# EAGLE design custom_hat_v_beta (EAGLE 9.6.2)
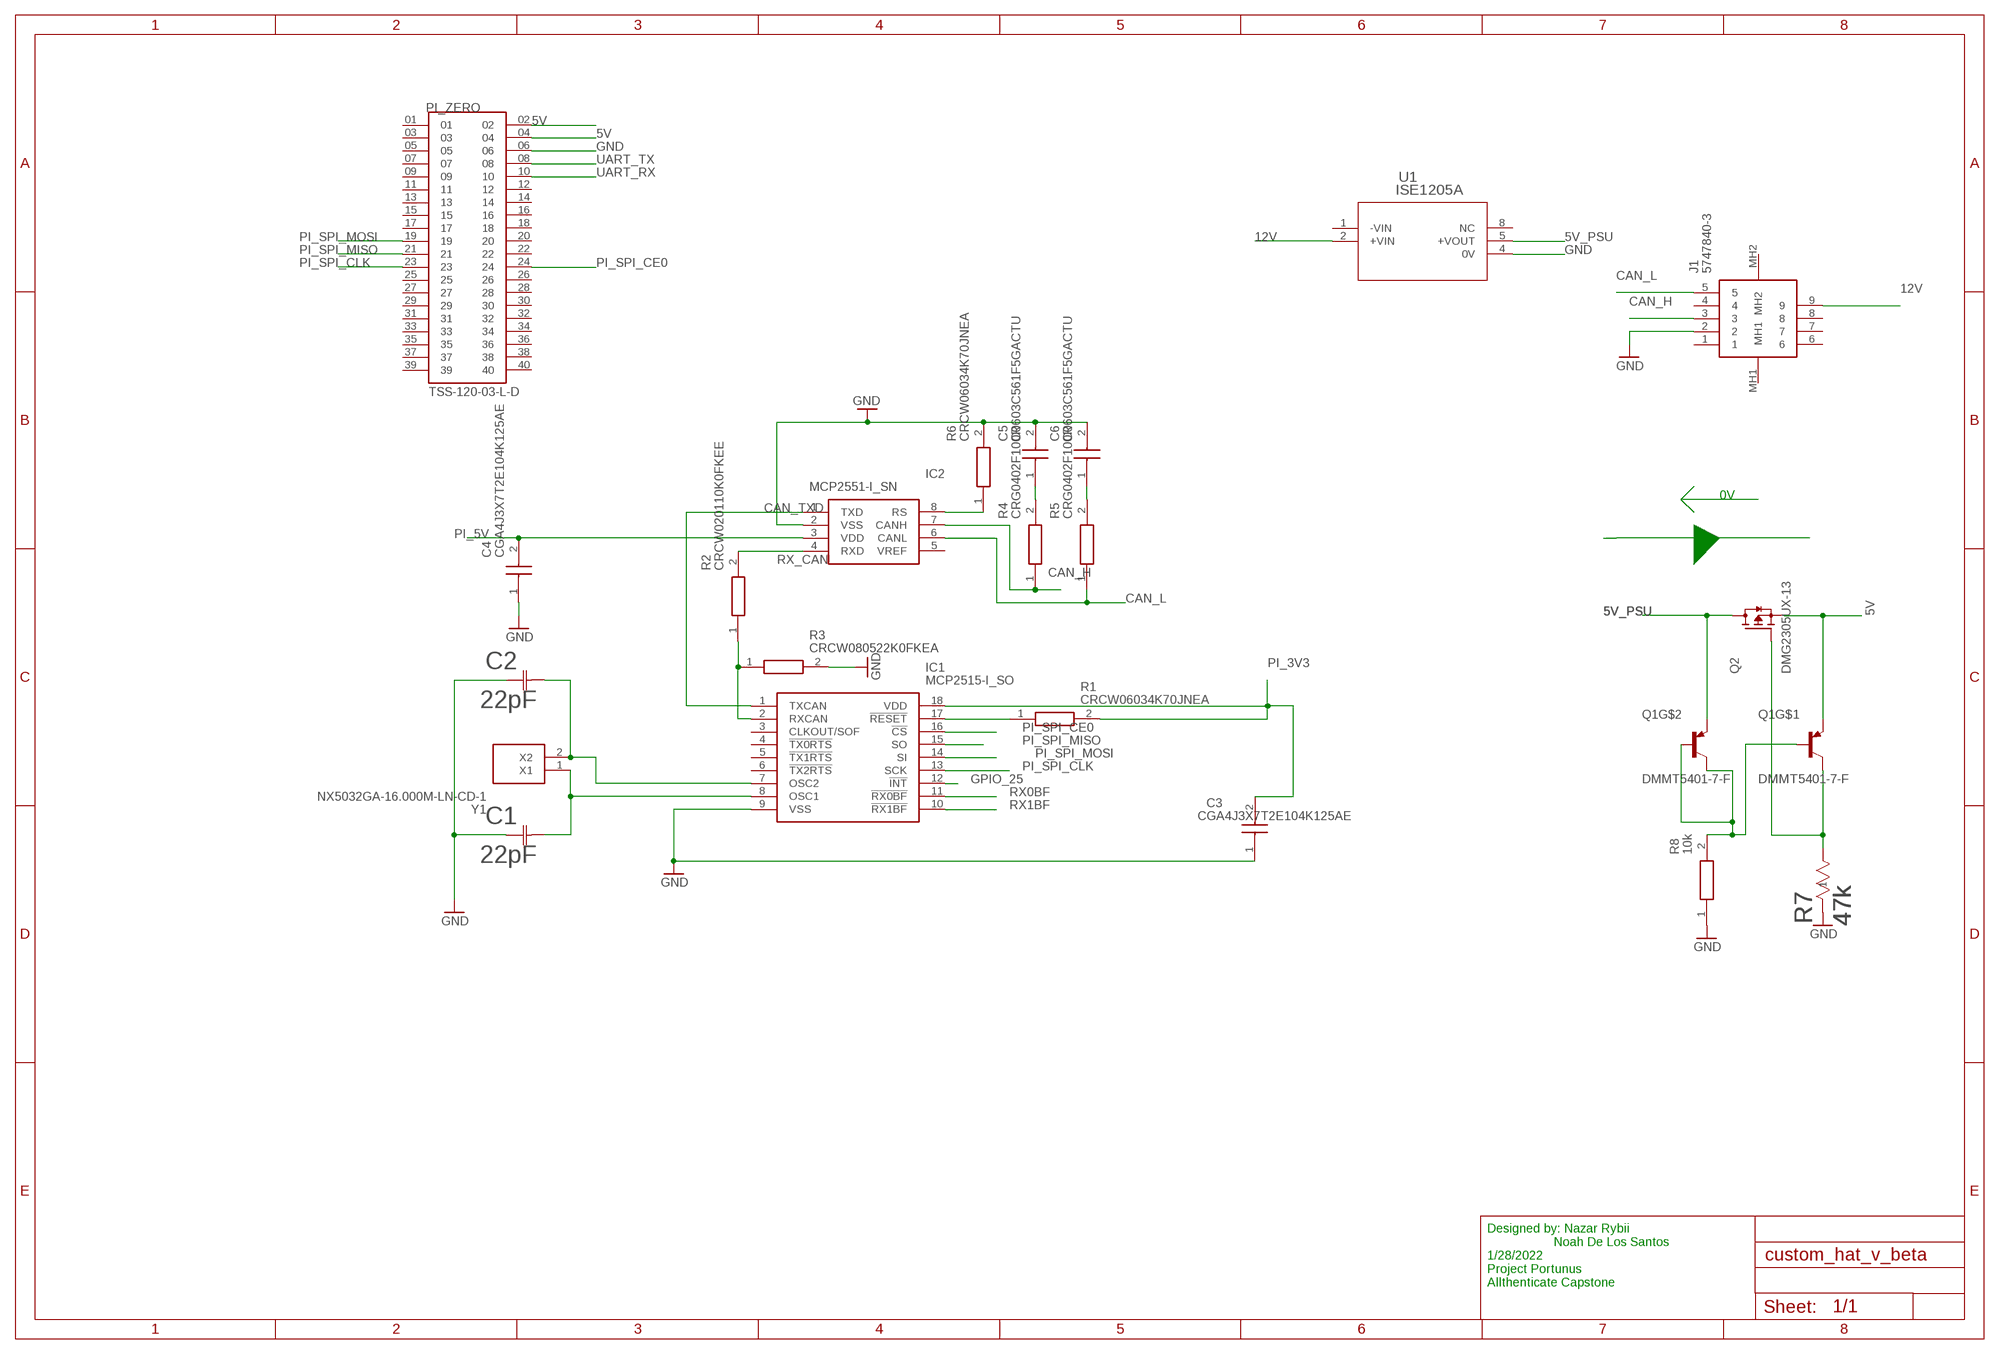
[diagram p0: schematic, sheet 1]

## Parts
C1  22pF  CL21C220JBANNNC  [CAP_CL21_SAM]
C2  22pF  CL21C220JBANNNC  [CAP_CL21_SAM]
C3  CGA4J3X7T2E104K125AE  [CAPC2012X145N]
C4  CGA4J3X7T2E104K125AE  [CAPC2012X145N]
C5  C0603C561F5GACTU  [CAPC1608X87N]
C6  C0603C561F5GACTU  [CAPC1608X87N]
IC1  MCP2515-I_SO  [SOIC127P1030X265-18N]
IC2  MCP2551-I_SN  [SOIC127P600X175-8N]
J1  5747840-3  [57478403]
PI_ZERO  TSS-120-03-L-D  [SAMTEC_TSS-120-03-L-D]
Q1  DMMT5401-7-F  [SOT95P285X140-6N]
Q2  DMG2305UX-13  [SOT91P240X110-3N]
R1  CRCW06034K70JNEA  [RESC1608X50N]
R2  CRCW020110K0FKEE  [RESC0603X28N]
R3  CRCW080522K0FKEA  [RESC2012X50N]
R4  CRG0402F100R  [RESC1005X40N]
R5  CRG0402F100R  [RESC1005X40N]
R6  CRCW06034K70JNEA  [RESC1608X50N]
R7  47k  RC0603FR-0747KL  [RC0603N_YAG]
R8  10k  CRCW080510K0FKEC  [RESC2012X50N]
U1  ISE1205A  [ISE1205A_XPP]
Y1  NX5032GA-16.000M-LN-CD-1  [NX5032GA16000000MHZLNCD1]

## Nets
5V: PI_ZERO.02 PI_ZERO.04 Q1.6(E) Q2.2(S)
5V_PSU: Q1.5(E) Q2.3(D) U1.5(+VOUT)
12V: J1.9 U1.2(+VIN)
CAN_H: IC2.7(CANH) J1.3 R4.1
CAN_L: IC2.6(CANL) J1.5 R5.1
CAN_TXD: IC1.1(TXCAN) IC2.1(TXD)
GND: C1.1 C2.1 C3.1 C4.1 C5.2 C6.2 IC1.9(VSS) IC2.2(VSS) J1.2 PI_ZERO.06 R3.2 R6.2 R7.1 R8.1 U1.4(0V)
GPIO_25: IC1.12(!INT)
N$3: Q1.1(C) Q2.1(G) R7.2
N$4: Q1.2(B) Q1.3(B) Q1.4(C) R8.2
N$5: IC1.2(RXCAN) R2.1 R3.1
N$11: IC2.8(RS) R6.1
N$13: C1.2 IC1.8(OSC1) Y1.1(X1)
N$14: C2.2 IC1.7(OSC2) Y1.2(X2)
N$15: C5.1 R4.2
N$16: C6.1 R5.2
N$21: IC1.17(!RESET) R1.1
PI_3V3: C3.2 IC1.18(VDD) R1.2
PI_5V: C4.2 IC2.3(VDD)
PI_SPI_CE0: IC1.16(!CS) PI_ZERO.24
PI_SPI_CLK: IC1.13(SCK) PI_ZERO.23
PI_SPI_MISO: IC1.15(SO) PI_ZERO.21
PI_SPI_MOSI: IC1.14(SI) PI_ZERO.19
RX0BF: IC1.11(!RX0BF)
RX1BF: IC1.10(!RX1BF)
RX_CAN: IC2.4(RXD) R2.2
UART_RX: PI_ZERO.10
UART_TX: PI_ZERO.08
Unconnected: IC1.3(CLKOUT/SOF) IC1.4(!TX0RTS) IC1.5(!TX1RTS) IC1.6(!TX2RTS) IC2.5(VREF) J1.1 J1.4 J1.6 J1.7 J1.8 J1.MH1 J1.MH2 PI_ZERO.01 PI_ZERO.03 PI_ZERO.05 PI_ZERO.07 PI_ZERO.09 PI_ZERO.11 PI_ZERO.12 PI_ZERO.13 PI_ZERO.14 PI_ZERO.15 PI_ZERO.16 PI_ZERO.17 PI_ZERO.18 PI_ZERO.20 PI_ZERO.22 PI_ZERO.25 PI_ZERO.26 PI_ZERO.27 PI_ZERO.28 PI_ZERO.29 PI_ZERO.30 PI_ZERO.31 PI_ZERO.32 PI_ZERO.33 PI_ZERO.34 PI_ZERO.35 PI_ZERO.36 PI_ZERO.37 PI_ZERO.38 PI_ZERO.39 PI_ZERO.40 U1.8(NC)

## Notes on the sheet
- 0V
- Designed by: Nazar Rybii
                     Noah De Los Santos
  1/28/2022
  Project Portunus
  Allthenticate Capstone

## Power pins joined to a net without a drawn wire
-VIN: U1.1(-VIN)

## Library data of the parts
C1 C2 = Custom_Hat_Library:CL21C220JBANNNC; COPYRIGHT: Copyright (C) 2022 Ultra Librarian. All rights reserved.; DIGI-KEY_PART_NUMBER_1: 1276-1047-2-ND; DIGI-KEY_PART_NUMBER_2: 1276-1047-1-ND; DIGI-KEY_PART_NUMBER_3: 1276-1047-6-ND; MANUFACTURER_PART_NUMBER: CL21C220JBANNNC; MFR_NAME: Samsung
C3 C4 = CGA4J3X7T2E104K125AE:CGA4J3X7T2E104K125AE: Capacitor Auto CGA 0805 250V 100nF X7T Source: Datasheet <https://datasheet.datasheetarchive.com/originals/distributors/Datasheets-DGA3/268663.pdf>; ARROW_PART_NUMBER: CGA4J3X7T2E104K125AE; ARROW_PRICE-STOCK: https://www.arrow.com/en/products/cga4j3x7t2e104k125ae/tdk?region=nac; DESCRIPTION: Capacitor Auto CGA 0805 250V 100nF X7T; HEIGHT: 1.45mm; MANUFACTURER_NAME: TDK; MANUFACTURER_PART_NUMBER: CGA4J3X7T2E104K125AE; MOUSER_PART_NUMBER: 810-CGA4J3X7T2E104KS; MOUSER_PRICE-STOCK: https://www.mouser.co.uk/ProductDetail/TDK/CGA4J3X7T2E104K125AE?qs=FxQuwy19cyCLbVWBJ25BJQ%3D%3D
C5 C6 = C0603C561F5GACTU:C0603C561F5GACTU: Multilayer Ceramic Capacitors MLCC - SMD/SMT 50volts 560pF C0G 1% Source: Datasheet <https://content.kemet.com/datasheets/KEM_C1003_C0G_SMD.pdf>; ARROW_PART_NUMBER: C0603C561F5GACTU; ARROW_PRICE-STOCK: https://www.arrow.com/en/products/c0603c561f5gactu/kemet-corporation; DESCRIPTION: Multilayer Ceramic Capacitors MLCC - SMD/SMT 50volts 560pF C0G 1%; HEIGHT: 0.87mm; MANUFACTURER_NAME: Kemet; MANUFACTURER_PART_NUMBER: C0603C561F5GACTU; MOUSER_PART_NUMBER: 80-C0603C561F5G; MOUSER_PRICE-STOCK: https://www.mouser.co.uk/ProductDetail/KEMET/C0603C561F5GACTU?qs=6dm3P68XlMDTfPQcBRhXNA%3D%3D
IC1 = MCP2515-I_SO:MCP2515-I_SO: CAN Controller SPI data filtering SO18 Source: Datasheet <https://datasheet.datasheetarchive.com/originals/distributors/Datasheets-34/DSA-675138.pdf>; ARROW_PART_NUMBER: MCP2515-I/SO; ARROW_PRICE-STOCK: https://www.arrow.com/en/products/mcp2515-iso/microchip-technology?region=nac; DESCRIPTION: CAN Controller SPI data filtering SO18; HEIGHT: 2.65mm; MANUFACTURER_NAME: Microchip; MANUFACTURER_PART_NUMBER: MCP2515-I/SO; MOUSER_PART_NUMBER: 579-MCP2515-I/SO; MOUSER_PRICE-STOCK: https://www.mouser.co.uk/ProductDetail/Microchip-Technology/MCP2515-I-SO?qs=KwArPi4cUogGDbGnphOvtQ%3D%3D
IC2 = MCP2551-I_SN:MCP2551-I_SN: High Speed CAN Transceiver,MCP2551-I/SN Source: Datasheet <https://datasheet.datasheetarchive.com/originals/distributors/Datasheets-34/DSA-674994.pdf>; ARROW_PART_NUMBER: MCP2551-I/SN; ARROW_PRICE-STOCK: https://www.arrow.com/en/products/mcp2551-isn/microchip-technology?region=nac; DESCRIPTION: High Speed CAN Transceiver,MCP2551-I/SN; HEIGHT: 1.75mm; MANUFACTURER_NAME: Microchip; MANUFACTURER_PART_NUMBER: MCP2551-I/SN; MOUSER_PART_NUMBER: 579-MCP2551-I/SN; MOUSER_PRICE-STOCK: https://www.mouser.co.uk/ProductDetail/Microchip-Technology/MCP2551-I-SN?qs=9y3LFqDLL8L5zFfqqxdOHg%3D%3D
J1 = 5747840-3:5747840-3: TE Connectivity Amplimite HD-20 Series, 9 Way Right Angle Through Hole PCB D-sub Connector Plug, 2.74mm Pitch, with Source: Datasheet <https://www.te.com/commerce/DocumentDelivery/DDEController?Action=srchrtrv&DocNm=5747840&DocType=Customer Drawing&DocLang=English>; ARROW_PART_NUMBER: 5747840-3; ARROW_PRICE-STOCK: https://www.arrow.com/en/products/5747840-3/te-connectivity?region=nac; DESCRIPTION: TE Connectivity Amplimite HD-20 Series, 9 Way Right Angle Through Hole PCB D-sub Connector Plug, 2.74mm Pitch, with; HEIGHT: 12.93mm; MANUFACTURER_NAME: TE Connectivity; MANUFACTURER_PART_NUMBER: 5747840-3; MOUSER_PART_NUMBER: 571-5747840-3; MOUSER_PRICE-STOCK: https://www.mouser.co.uk/ProductDetail/TE-Connectivity/5747840-3?qs=x6EjVpvqMVNS%252B6EaV6pwhg%3D%3D
PI_ZERO = Custom_Hat_Library:TSS-120-03-L-D: Check availability <https://pricing.snapeda.com/parts/TSS-120-03-L-D/Samtec/view-part?ref=eda>; AVAILABILITY: In Stock; DESCRIPTION: Connector Header Through Hole 40 position 0.100 (2.54mm); MF: Samtec; MP: TSS-120-03-L-D; PACKAGE: None; PRICE: None; PURCHASE-URL: https://pricing.snapeda.com/search/part/TSS-120-03-L-D/?ref=eda
Q1 = Custom_Hat_Library:DMMT5401-7-F: DMMT5401 Series PNP 150 V 300 mW Small Signal Transistor SMT - SOT-26-6 Check availability <https://pricing.snapeda.com/parts/DMMT5401-7-F/Diodes%20Inc./view-part?ref=eda>; AVAILABILITY: In Stock; DESCRIPTION: Bipolar (BJT) Transistor Array 2 PNP (Dual) Matched Pair 150V 200mA 300MHz 300mW Surface Mount SOT-26; MF: Diodes Inc.; MP: DMMT5401-7-F; PACKAGE: SOT-23 Diodes Inc.; PRICE: None; PURCHASE-URL: https://pricing.snapeda.com/search/part/DMMT5401-7-F/?ref=eda
Q2 = Custom_Hat_Library:DMG2305UX-13: DMG2305UX Series 20 V 65 Ohms P-Ch Enhancement Mode Mosfet - SOT-23-3 Check availability <https://pricing.snapeda.com/parts/DMG2305UX-13/Diodes%20Inc./view-part?ref=eda>; AVAILABILITY: In Stock; DESCRIPTION: P-Channel 20 V 4.2A (Ta) 1.4W (Ta) Surface Mount SOT-23-3; MF: Diodes Inc.; MP: DMG2305UX-13; PACKAGE: SOT-23 Diodes Inc.; PRICE: None; PURCHASE-URL: https://pricing.snapeda.com/search/part/DMG2305UX-13/?ref=eda
R1 R6 = CRCW06034K70JNEA:CRCW06034K70JNEA: Vishay CRCW Series Thick Film Surface Mount Resistor 0603 Case 4.7k +/-5% 0.1W +/-200ppm/K Source: Datasheet <http://www.vishay.com/docs/20035/dcrcwe3.pdf>; ARROW_PART_NUMBER: CRCW06034K70JNEA; ARROW_PRICE-STOCK: https://www.arrow.com/en/products/crcw06034k70jnea/vishay; DESCRIPTION: Vishay CRCW Series Thick Film Surface Mount Resistor 0603 Case 4.7k +/-5% 0.1W +/-200ppm/K; HEIGHT: 0.5mm; MANUFACTURER_NAME: Vishay; MANUFACTURER_PART_NUMBER: CRCW06034K70JNEA; MOUSER_PART_NUMBER: 71-CRCW0603J-4.7K-E3; MOUSER_PRICE-STOCK: https://www.mouser.co.uk/ProductDetail/Vishay-Dale/CRCW06034K70JNEA?qs=C0xaqriB68jbLUpBrIbing%3D%3D
R2 = CRCW020110K0FKEE:CRCW020110K0FKEE: Standard Thick Film Chip Resistors value 10K0 ohm. Source: Datasheet <http://www.vishay.com/docs/20035/dcrcwe3.pdf>; ARROW_PART_NUMBER: CRCW020110K0FKEE; ARROW_PRICE-STOCK: https://www.arrow.com/en/products/crcw020110k0fkee/vishay; DESCRIPTION: Standard Thick Film Chip Resistors value 10K0 ohm.; HEIGHT: 0.28mm; MANUFACTURER_NAME: Vishay; MANUFACTURER_PART_NUMBER: CRCW020110K0FKEE
R3 = CRCW080522K0FKEA:CRCW080522K0FKEA: Vishay CRCW Series Thick Film Surface Mount Resistor 805 Case 22k +/-1% 0.125W +/-100ppm/C Source: Datasheet <http://www.vishay.com/docs/20035/dcrcwe3.pdf>; ARROW_PART_NUMBER: CRCW080522K0FKEA; ARROW_PRICE-STOCK: https://www.arrow.com/en/products/crcw080522k0fkea/vishay; DESCRIPTION: Vishay CRCW Series Thick Film Surface Mount Resistor 805 Case 22k +/-1% 0.125W +/-100ppm/C; HEIGHT: 0.5mm; MANUFACTURER_NAME: Vishay; MANUFACTURER_PART_NUMBER: CRCW080522K0FKEA; MOUSER_PART_NUMBER: 71-CRCW0805-22K-E3; MOUSER_PRICE-STOCK: https://www.mouser.co.uk/ProductDetail/Vishay-Dale/CRCW080522K0FKEA/?qs=fIsz7OpyEY835T0D7WGkRw%3D%3D
R4 R5 = CRG0402F100R:CRG0402F100R: TE Connectivity CRG0402 Series Thick Film Surface Mount Resistor 402 Case 100 +/-1% 0.063W +/-100ppm/C Source: Datasheet <https://datasheet.datasheetarchive.com/originals/distributors/DKDS-21/401698.pdf>; ARROW_PART_NUMBER: CRG0402F100R; ARROW_PRICE-STOCK: https://www.arrow.com/en/products/crg0402f100r/te-connectivity; DESCRIPTION: TE Connectivity CRG0402 Series Thick Film Surface Mount Resistor 402 Case 100 +/-1% 0.063W +/-100ppm/C; HEIGHT: 0.4mm; MANUFACTURER_NAME: TE Connectivity; MANUFACTURER_PART_NUMBER: CRG0402F100R; MOUSER_PART_NUMBER: 279-CRG0402F100R; MOUSER_PRICE-STOCK: https://www.mouser.co.uk/ProductDetail/TE-Connectivity-Holsworthy/CRG0402F100R?qs=s1WWODT2SXWUp2XB3WBFSA%3D%3D
R7 = Custom_Hat_Library:RC0603FR-0747KL; COPYRIGHT: Copyright (C) 2022 Ultra Librarian. All rights reserved.; DIGI-KEY_PART_NUMBER_1: 311-47.0KHRCT-ND; DIGI-KEY_PART_NUMBER_2: 311-47.0KHRDKR-ND; DIGI-KEY_PART_NUMBER_3: 311-47.0KHRTR-ND; DIGI-KEY_PART_NUMBER_4: 311-47.0KHRTR-NDL; MANUFACTURER_PART_NUMBER: RC0603FR-0747KL; MFR_NAME: Yageo
R8 = Custom_Hat_Library:CRCW080510K0FKEC: VISHAY - CRCW080510K0FKEC - RES, AEC-Q200, THICK FILM, 10K, 0805 Source: Datasheet <http://www.vishay.com/docs/20035/dcrcwe3.pdf>; ARROW_PART_NUMBER: CRCW080510K0FKEC; ARROW_PRICE-STOCK: https://www.arrow.com/en/products/crcw080510k0fkec/vishay; DESCRIPTION: VISHAY - CRCW080510K0FKEC - RES, AEC-Q200, THICK FILM, 10K, 0805; HEIGHT: 0.5mm; MANUFACTURER_NAME: Vishay; MANUFACTURER_PART_NUMBER: CRCW080510K0FKEC; MOUSER_PART_NUMBER: 71-CRCW080510K0FKEC; MOUSER_PRICE-STOCK: https://www.mouser.co.uk/ProductDetail/Vishay-Dale/CRCW080510K0FKEC?qs=Uz%2FpZV6aOq01IlV1moChPA%3D%3D
U1 = Custom_Hat_Library:ISE1205A; COPYRIGHT: Copyright (C) 2022 Ultra Librarian. All rights reserved.; DIGI-KEY_PART_NUMBER_1: 1470-2948-2-ND; DIGI-KEY_PART_NUMBER_2: 1470-2948-1-ND; DIGI-KEY_PART_NUMBER_3: 1470-2948-6-ND; DIGI-KEY_PART_NUMBER_4: ISE1205A-ND; MANUFACTURER_PART_NUMBER: ISE1205A; MFR_NAME: XP Power
Y1 = NX5032GA-16.000M-LN-CD-1:NX5032GA-16.000M-LN-CD-1: Crystals CRYSTAL 16MHZ 8PF SMD Source: Datasheet <https://media.digikey.com/pdf/Data Sheets/NDK PDFs/NX5032GA.pdf>; DESCRIPTION: Crystals CRYSTAL 16MHZ 8PF SMD; HEIGHT: 1.5mm; MANUFACTURER_NAME: NDK; MANUFACTURER_PART_NUMBER: NX5032GA-16.000M-LN-CD-1; MOUSER_PART_NUMBER: 344-NX5032GA16MLNCD1; MOUSER_PRICE-STOCK: https://www.mouser.co.uk/ProductDetail/NDK/NX5032GA-16000M-LN-CD-1?qs=55YtniHzbhDnyNixVDBwYw%3D%3D

## Board
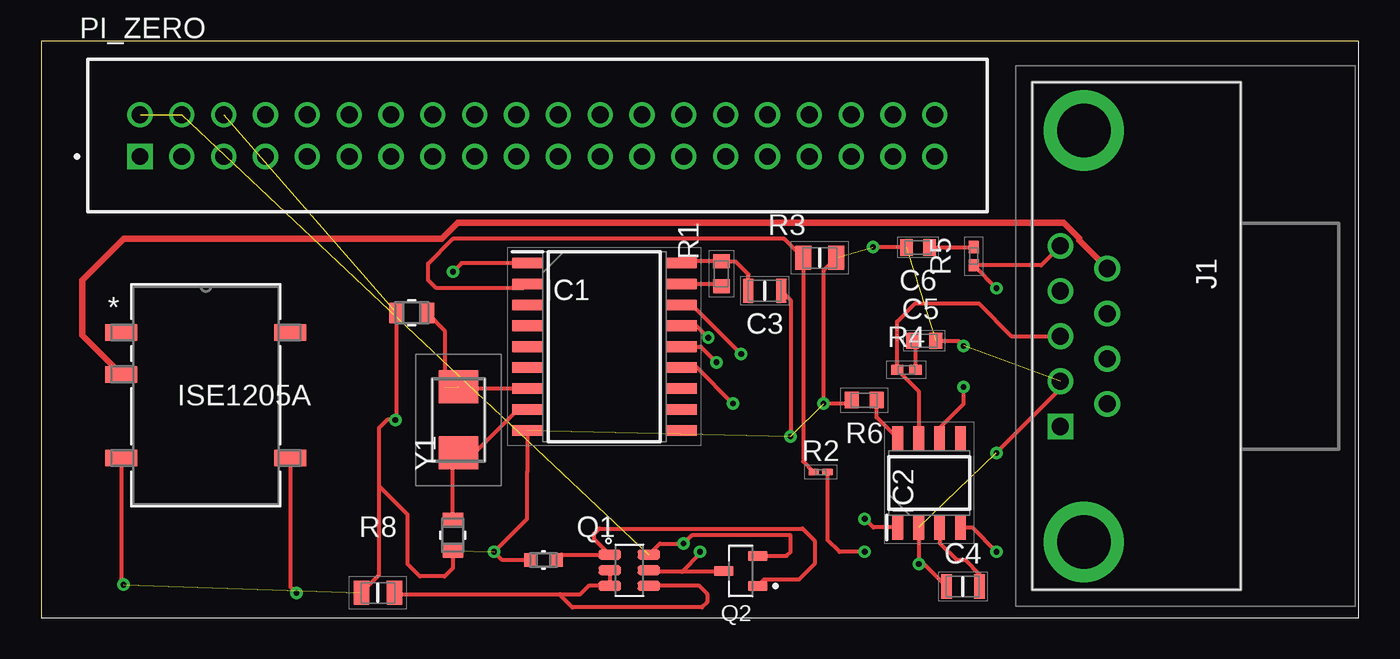
[diagram p1: board, top side]
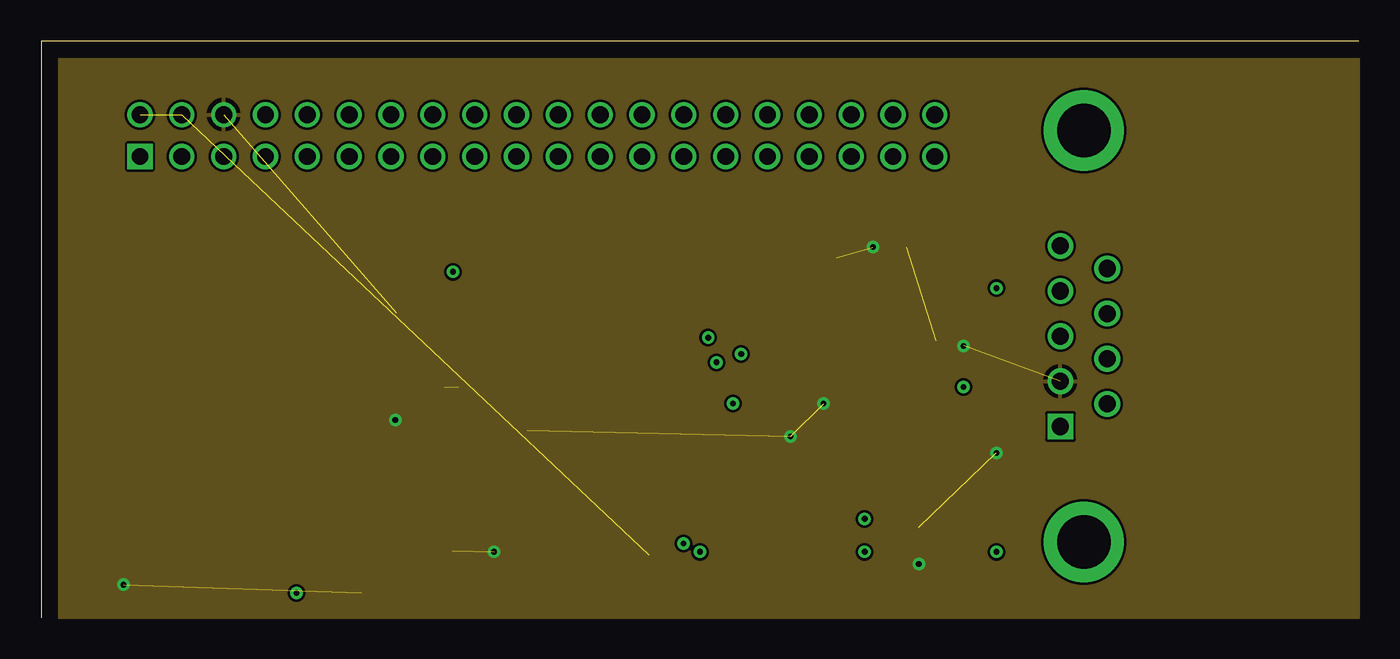
[diagram p2: board, inner layer Route2]
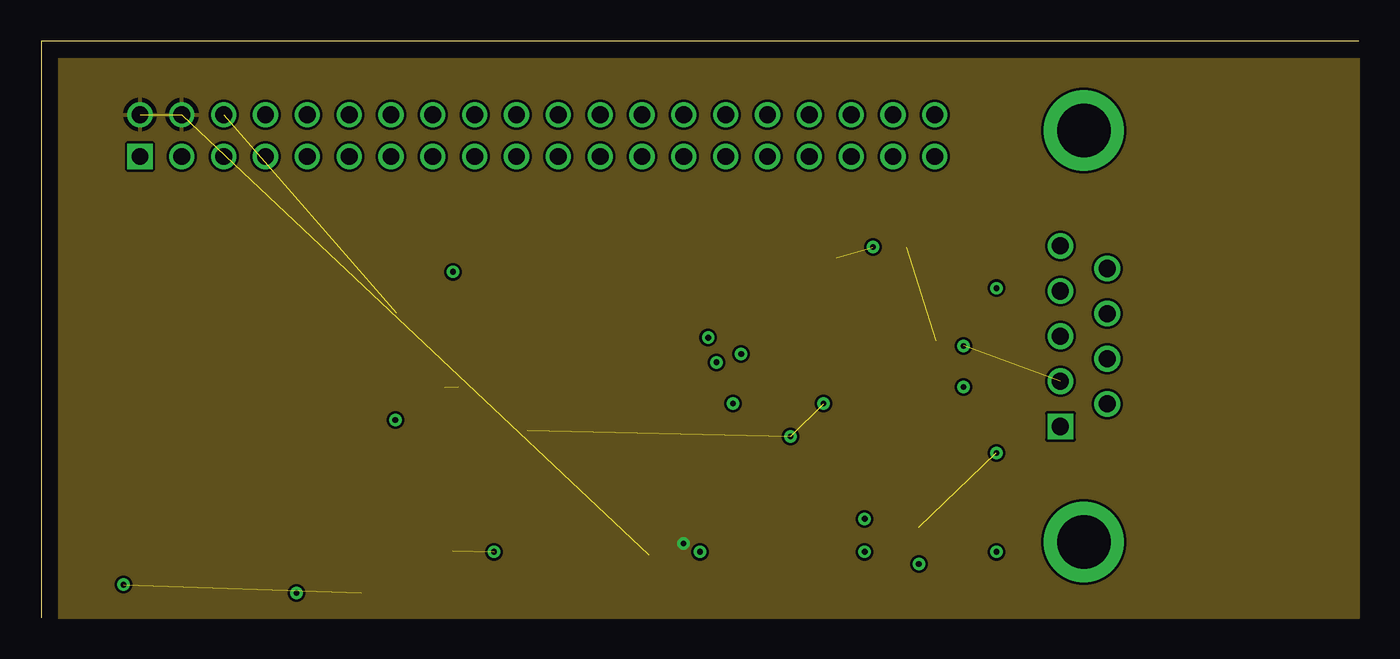
[diagram p3: board, inner layer Route15]
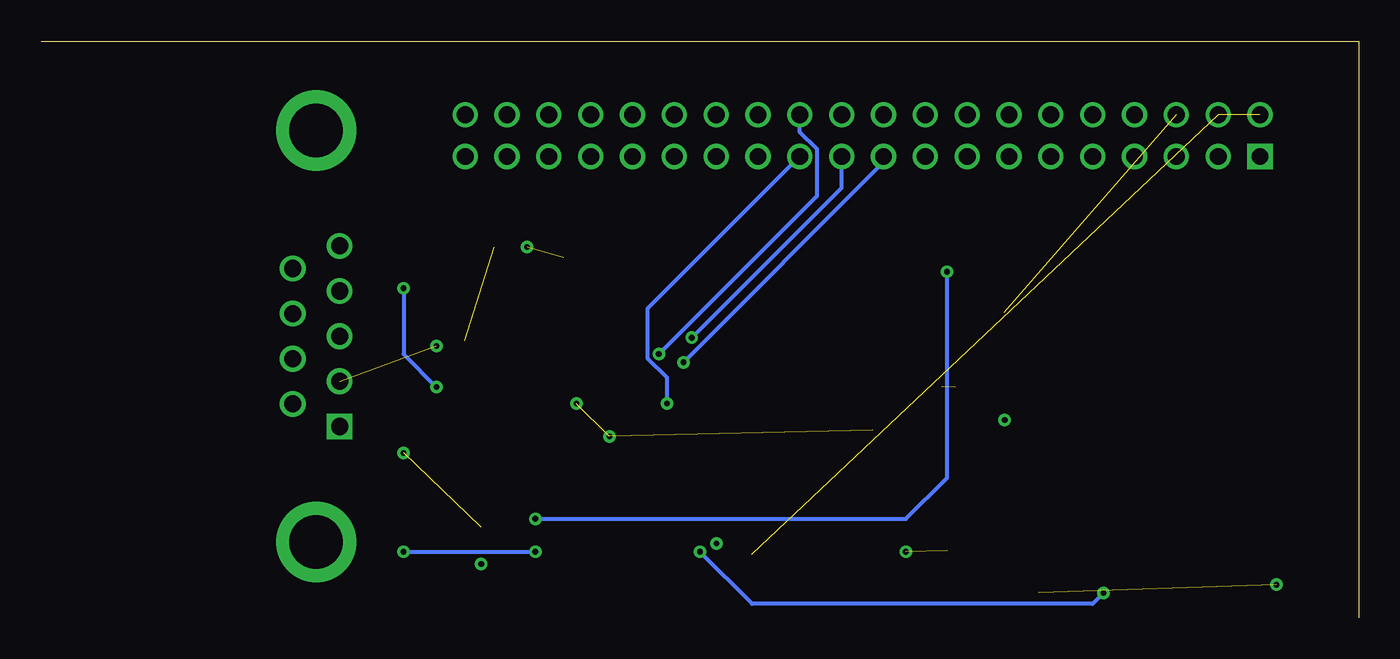
[diagram p4: board, bottom side, seen from below]

Size 80 x 35 mm. Coordinates in mm from the lower left corner, seen from the top.
Outline: 80,35 0,35 0,0
Copper layers (1+2*15+16): Top 0.035mm / dielectric 1.5mm / Route2 0.035mm / dielectric 0.15mm / Route15 0.035mm / dielectric 0.2mm / Bottom 0.035mm
Design rules "default *": minimum track width 10mil, minimum drill 0.35mm, track to track 6mil, track to pad 6mil, pad to pad 6mil, via to via 6mil, smd to smd 6mil, copper to edge 40mil, drill to drill 6mil, minimum pad ring 10mil, minimum via ring 8mil, stop-mask expansion 4mil, vias tented up to drill 0mil, thermal gap 10mil

### Footprints (pad centres in the part's own frame; a part is rotated, then mirrored left to right if it is on the bottom)
CAP_CL21_SAM = smd 0.856 x 1.25: 1 -0.928,0; 2 0.928,0
CAPC2012X145N = smd 0.62 x 1.47: 1 -1,0; 2 1,0
CAPC1608X87N = smd 0.78 x 0.98: 1 -0.7,0; 2 0.7,0
SOIC127P1030X265-18N = smd 1.85 x 0.65: 1 -4.675,5.08; 2 -4.675,3.81; 3 -4.675,2.54; 4 -4.675,1.27; 5 -4.675,0; 6 -4.675,-1.27; 7 -4.675,-2.54; 8 -4.675,-3.81; 9 -4.675,-5.08; 10 4.675,-5.08; 11 4.675,-3.81; 12 4.675,-2.54; 13 4.675,-1.27; 14 4.675,0; 15 4.675,1.27; 16 4.675,2.54; 17 4.675,3.81; 18 4.675,5.08
SOIC127P600X175-8N = smd 1.5 x 0.65: 1 -2.7,1.905; 2 -2.7,0.635; 3 -2.7,-0.635; 4 -2.7,-1.905; 5 2.7,-1.905; 6 2.7,-0.635; 7 2.7,0.635; 8 2.7,1.905
57478403 = drill 1.04 pad 1.56 square: 1 0,0 | drill 1.04 pad 1.56: 2 2.74,0; 3 5.48,0; 4 8.22,0; 5 10.96,0; 6 1.37,-2.84; 7 4.11,-2.84; 8 6.85,-2.84; 9 9.59,-2.84 | drill 3.25 pad 4.875: MH1 -7.015,-1.42; MH2 17.975,-1.42
SAMTEC_TSS-120-03-L-D = drill 1.02 pad 1.37 square: 01 0,0 | drill 1.02 pad 1.37: 02 0,2.54; 03 2.54,0; 04 2.54,2.54; 05 5.08,0; 06 5.08,2.54; 07 7.62,0; 08 7.62,2.54; 09 10.16,0; 10 10.16,2.54; 11 12.7,0; 12 12.7,2.54; 13 15.24,0; 14 15.24,2.54; 15 17.78,0; 16 17.78,2.54; 17 20.32,0; 18 20.32,2.54; 19 22.86,0; 20 22.86,2.54; 21 25.4,0; 22 25.4,2.54; 23 27.94,0; 24 27.94,2.54; 25 30.48,0; 26 30.48,2.54; 27 33.02,0; 28 33.02,2.54; 29 35.56,0; 30 35.56,2.54; 31 38.1,0; 32 38.1,2.54; 33 40.64,0; 34 40.64,2.54; 35 43.18,0; 36 43.18,2.54; 37 45.72,0; 38 45.72,2.54; 39 48.26,0; 40 48.26,2.54
SOT95P285X140-6N = smd 1.35 x 0.6: 1 -1.185,0.95; 2 -1.185,0; 3 -1.185,-0.95; 4 1.185,-0.95; 5 1.185,0; 6 1.185,0.95
SOT91P240X110-3N = smd 1.18 x 0.61: 1 -1.025,0.915; 2 -1.025,-0.915; 3 1.025,0
RESC1608X50N = smd 0.85 x 1: 1 -0.75,0; 2 0.75,0
RESC0603X28N = smd 0.625 x 0.4: 1 -0.412,0; 2 0.412,0
RESC2012X50N = smd 0.95 x 1.45: 1 -1,0; 2 1,0
RESC1005X40N = smd 0.75 x 0.6: 1 -0.55,0; 2 0.55,0
RC0603N_YAG = smd 0.762 x 0.813: 1 -0.775,0; 2 0.775,0
ISE1205A_XPP = smd 1.956 x 1.016: 1 -5.131,3.81; 2 -5.131,1.27; 4 -5.131,-3.81; 5 5.131,-3.81; 8 5.131,3.81
NX5032GA16000000MHZLNCD1 = smd 2 x 2.4: 1 -2,0; 2 2,0

### Placement (x,y rotation side)
C1  25,5 90 top
C2  22.5,18.5 0 top
C3  43.93,19.85 180 top
C4  55.97,1.89 0 top
C5  53.62,16.81 0 top
C6  53.24,22.48 180 top
IC1  34.19,16.45 0 top
IC2  53.91,8.18 90 top
J1  61.88,11.61 90 top
PI_ZERO  6,28 0 top
Q1  35.71,2.88 0 top
Q2  42.47,2.84 180 top
R1  41.3,20.88 90 top
R2  47.32,8.84 0 top
R3  47.27,21.85 0 top
R4  52.52,15.04 0 top
R5  56.61,21.94 90 top
R6  49.98,13.2 180 top
R7  30.5,3.5 0 top
R8  20.44,1.51 0 top
U1  10,13.5 0 top
Y1  25.34,12.01 90 top

### Tracks (layer width: path | path; a pad name or v marks a point on that pad's centre or on a via)
5V  (via drill 0.35)  (2 unrouted)
  Top 0.254: Q1.6 37.57,4.5 v39,4.5 39.5,5 45.5,5 45.5,4 45.25,3.75 Q2.2
  pour Route15: 0,0 80,0 80,34.88 79.98,34.9 0.9,34.9 0,34
5V_PSU  (via drill 0.35)
  Top 0.254: Q1.5 36.99,2.79 38.91,2.79 | Q2.3 41.4,2.79 38.91,2.79 | v40,4 40,3.87 38.91,2.79 | U1.5 15.13,1.87 v15.5,1.5
  Bottom 0.254: v15.5,1.5 16.17,0.83 36.83,0.83 v40,4
12V
  Top 0.406: U1.2 2.5,17.14 2.5,20.5 5,23 24.32,23 25.3,23.98 62.08,23.98 63.02,23.04 63.02,22.9 J1.9
CAN_H
  Top 0.254: IC2.7 53.28,13.74 R4.1 51.97,17.97 53.08,19.07 56.92,19.07 58.91,17.09 J1.3
CAN_L  (via drill 0.35)
  Top 0.254: J1.5 60.71,21.39 R5.1 v58,20 | v56,14 56,12.97 54.55,11.52 IC2.6
  Bottom 0.254: v58,20 58,16 v56,14
CAN_TXD  (via drill 0.35)
  Top 0.254: IC2.1 50.52,5.48 v50,6 | v25,21 25.53,21.53 IC1.1
  Bottom 0.254: v50,6 27.5,6 25,8.5 v25,21
GND  (via drill 0.35)  (9 unrouted)
  Top 0.254: C4.1 53.59,3.26 v53.29,3.26 IC2.2 | 20.5,8 22.25,6.25 22.25,3.25 23,2.5 24.5,2.5 25,3 C1.1 | 20.5,8 20.5,11.5 21,12 v21.5,12 21.57,12.07 C2.1 | 20.5,8 20.5,2.56 R8.1 | IC1.9 29.52,8.87 29.5,8.85 29.5,6 v27.5,4 28,3.5 R7.1 | R3.2 47.5,21.08 v47.5,13 49.02,13 R6.2 | C3.1 45.5,19.28 v45.5,11 | C5.2 55.69,16.81 v56,16.5 | C6.2 50.52,22.48 v50.5,22.5 | v58,10 61.88,13.88 J1.2 | U1.4 4.87,2.13 v5,2
  pour Route2: 0,0 80,0 80,34.88 79.98,34.9 0.9,34.9 0,34
N$3
  Top 0.254: Q2.1 43.88,2.3 46,2.3 46.97,3.27 46.97,4.67 46.23,5.41 33.88,5.41 33.58,5.11 33.58,4.77 Q1.1 31.6,3.83 R7.2
N$4
  Top 0.254: Q1.2 Q1.3 33.24,1.93 32.74,1.42 31.5,1.42 | R8.2 21.44,1.42 31.5,1.42 | Q1.4 36.94,1.96 39.92,1.96 40.44,1.45 40.44,0.94 40.12,0.62 32.24,0.62 31.5,1.37 31.5,1.42
N$5
  Top 0.254: R2.1 46.27,9.48 R3.1 45.11,23 25,23 23.5,21.5 23.5,20.5 24,20 29.26,20 IC1.2
N$11
  Top 0.254: IC2.8 50.73,12.16 R6.1
N$13
  Top 0.254: 25,9.67 24.95,9.62 | IC1.8 28.97,12.64 26.34,10.01 Y1.1 25.16,9.84 25,9.67 | C1.2 25,9.67
N$14  (1 unrouted)
  Top 0.254: IC1.7 25.43,13.91 Y1.2 | C2.2 24.5,17.43 24.5,14
N$15
  Top 0.254: C5.1 53.07,16.65 R4.2
N$16
  Top 0.254: C6.1 56.6,22.48 R5.2
N$21
  Top 0.254: IC1.17 41.17,20.26 R1.1
PI_3V3
  Top 0.254: IC1.18 38.97,21.63 R1.2 42.15,21.63 42.93,20.85 C3.2
PI_5V
  Top 0.254: IC2.3 54.55,4.53 55.58,3.5 56.11,3.5 56.97,2.65 C4.2
PI_SPI_CE0  (via drill 0.35)
  Top 0.254: v42.5,16 39.51,18.99 IC1.16
  Bottom 0.254: PI_ZERO.24 33.94,29.48 32.9,28.43 32.9,25.6 v42.5,16
PI_SPI_CLK  (via drill 0.35)
  Top 0.254: v42,13 39.82,15.18 IC1.13
  Bottom 0.254: v42,13 42,14.57 43.16,15.73 43.16,18.78 PI_ZERO.23
PI_SPI_MISO  (via drill 0.35)
  Top 0.254: v40.5,17 39.78,17.72 IC1.15
  Bottom 0.254: v40.5,17 31.4,26.1 PI_ZERO.21
PI_SPI_MOSI  (via drill 0.35)
  Top 0.254: v41,15.5 40.05,16.45 IC1.14
  Bottom 0.254: v41,15.5 28.86,27.64 PI_ZERO.19
RX_CAN  (via drill 0.35)
  Top 0.254: IC2.4 56.52,5.48 v58,4 | v50,4 48.48,4 47.74,4.74 R2.2
  Bottom 0.254: v58,4 v50,4